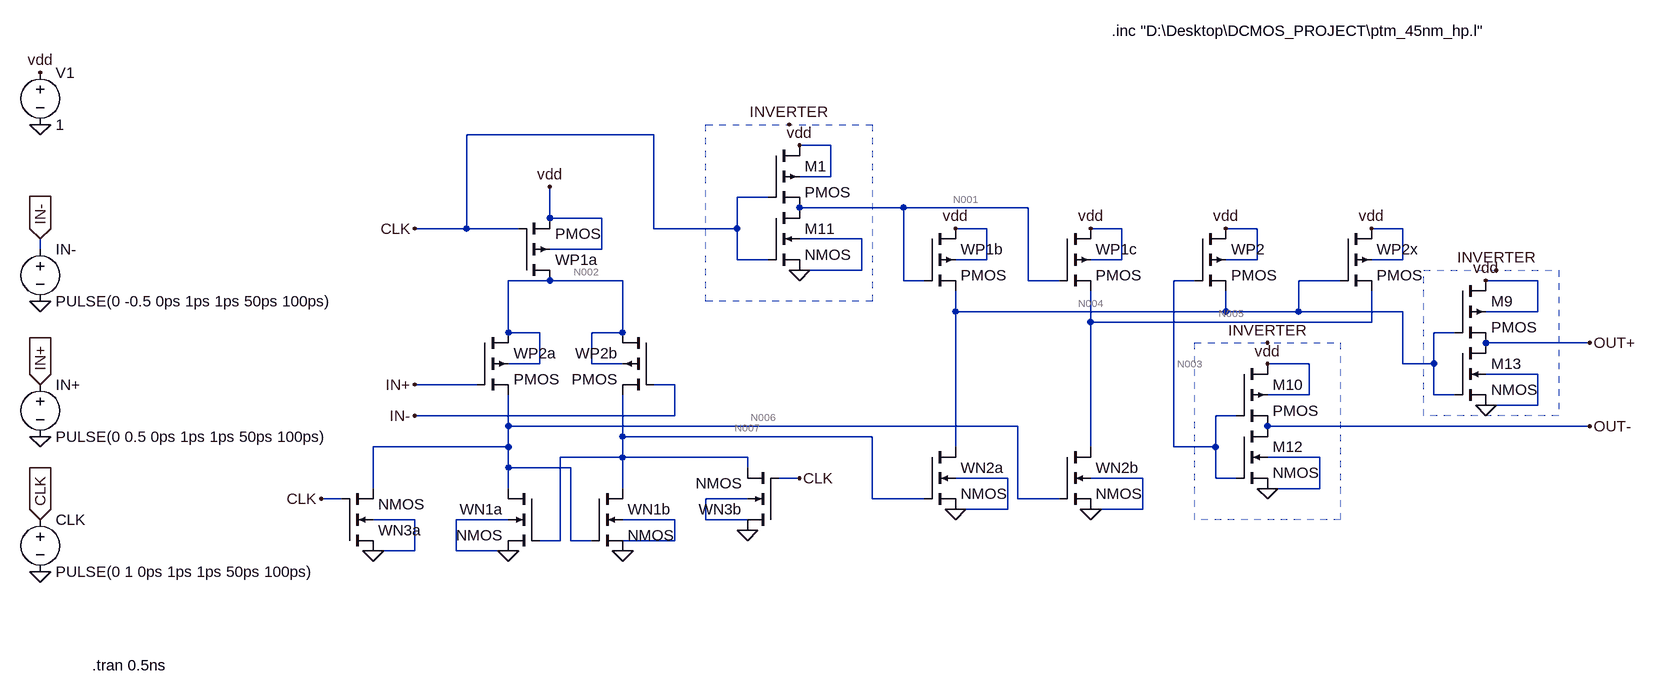
[diagram p0: schematic LSA.asc]
LSA.asc, the LTspice schematic file:
Version 4
SHEET 1 1348 720
WIRE -176 -112 -464 -112
WIRE 96 -96 48 -96
WIRE 96 -48 96 -96
WIRE 96 -48 48 -48
WIRE 0 -16 -48 -16
WIRE 208 0 48 0
WIRE 400 0 208 0
WIRE -336 16 -336 -32
WIRE -256 16 -336 16
WIRE -464 32 -464 -112
WIRE -464 32 -544 32
WIRE -384 32 -464 32
WIRE -176 32 -176 -112
WIRE -48 32 -48 -16
WIRE -48 32 -176 32
WIRE 336 32 288 32
WIRE 544 32 496 32
WIRE 752 32 704 32
WIRE 976 32 928 32
WIRE 144 48 48 48
WIRE -1120 64 -1120 48
WIRE -256 64 -256 16
WIRE -256 64 -336 64
WIRE -48 80 -48 32
WIRE 0 80 -48 80
WIRE 336 80 336 32
WIRE 336 80 288 80
WIRE 544 80 544 32
WIRE 544 80 496 80
WIRE 752 80 752 32
WIRE 752 80 704 80
WIRE 976 80 976 32
WIRE 976 80 928 80
WIRE 144 96 144 48
WIRE 144 96 48 96
WIRE -336 112 -400 112
WIRE -224 112 -336 112
WIRE 208 112 208 0
WIRE 240 112 208 112
WIRE 400 112 400 0
WIRE 448 112 400 112
WIRE 656 112 624 112
WIRE 880 112 816 112
WIRE 1184 112 1104 112
WIRE 288 160 288 128
WIRE 704 160 704 128
WIRE 704 160 288 160
WIRE 816 160 816 112
WIRE 816 160 704 160
WIRE 976 160 816 160
WIRE 1184 160 1184 112
WIRE 1184 160 1104 160
WIRE 496 176 496 128
WIRE 928 176 928 128
WIRE 928 176 496 176
WIRE -400 192 -400 112
WIRE -352 192 -400 192
WIRE -224 192 -224 112
WIRE -224 192 -272 192
WIRE 1056 192 1024 192
WIRE 1264 208 1104 208
WIRE -352 240 -352 192
WIRE -352 240 -400 240
WIRE -272 240 -272 192
WIRE -224 240 -272 240
WIRE 832 240 768 240
WIRE 976 240 976 160
WIRE 1024 240 1024 192
WIRE 1024 240 976 240
WIRE 1184 256 1104 256
WIRE -448 272 -544 272
WIRE -144 272 -176 272
WIRE 832 288 832 240
WIRE 832 288 768 288
WIRE 1024 288 1024 240
WIRE 1056 288 1024 288
WIRE 1184 304 1184 256
WIRE 1184 304 1104 304
WIRE -144 320 -144 272
WIRE -144 320 -544 320
WIRE 720 320 688 320
WIRE -400 336 -400 288
WIRE 384 336 -400 336
WIRE 1264 336 768 336
WIRE -224 352 -224 288
WIRE 160 352 -224 352
WIRE -400 368 -400 336
WIRE -400 368 -608 368
WIRE 288 368 288 160
WIRE 496 368 496 176
WIRE 624 368 624 112
WIRE 688 368 688 320
WIRE 688 368 624 368
WIRE -224 384 -224 352
WIRE -224 384 -320 384
WIRE -32 384 -224 384
WIRE 848 384 768 384
WIRE -400 400 -400 368
WIRE -304 400 -400 400
WIRE -32 400 -32 384
WIRE 48 416 16 416
WIRE 368 416 288 416
WIRE 576 416 496 416
WIRE 688 416 688 368
WIRE 720 416 688 416
WIRE -608 432 -608 368
WIRE -400 432 -400 400
WIRE -224 432 -224 384
WIRE 848 432 848 384
WIRE 848 432 768 432
WIRE -656 448 -688 448
WIRE -32 448 -96 448
WIRE 160 448 160 352
WIRE 240 448 160 448
WIRE 384 448 384 336
WIRE 448 448 384 448
WIRE 368 464 368 416
WIRE 368 464 288 464
WIRE 576 464 576 416
WIRE 576 464 496 464
WIRE -544 480 -608 480
WIRE -400 480 -480 480
WIRE -144 480 -224 480
WIRE -96 480 -96 448
WIRE -32 480 -96 480
WIRE -32 496 -32 480
WIRE -320 512 -320 384
WIRE -320 512 -352 512
WIRE -304 512 -304 400
WIRE -272 512 -304 512
WIRE -144 512 -144 480
WIRE -144 512 -224 512
WIRE -544 528 -544 480
WIRE -544 528 -608 528
WIRE -480 528 -480 480
WIRE -400 528 -480 528
WIRE -224 528 -224 512
FLAG -336 -32 vdd
FLAG 48 -96 vdd
FLAG 288 32 vdd
FLAG 496 32 vdd
FLAG 704 32 vdd
FLAG 928 32 vdd
FLAG 1104 112 vdd
FLAG 768 240 vdd
FLAG -608 528 0
FLAG -400 528 0
FLAG -224 528 0
FLAG 288 464 0
FLAG 496 464 0
FLAG 768 432 0
FLAG 1104 304 0
FLAG 48 96 0
FLAG -32 496 0
FLAG 48 416 CLK
FLAG -688 448 CLK
FLAG -544 32 CLK
FLAG -544 272 IN+
FLAG -544 320 IN-
FLAG 1264 208 OUT+
FLAG 1264 336 OUT-
FLAG 768 208 INVERTER
FLAG 1120 96 INVERTER
FLAG 32 -128 INVERTER
FLAG -1120 352 0
FLAG -1120 560 0
FLAG -1120 144 0
FLAG -1120 48 IN-
IOPIN -1120 48 In
FLAG -1120 272 IN+
IOPIN -1120 272 In
FLAG -1120 480 CLK
IOPIN -1120 480 In
FLAG -1120 -128 0
FLAG -1120 -208 vdd
SYMBOL pmos4 0 -96 R0
SYMATTR InstName M1
SYMATTR Value2 l=45nm w=180nm
SYMBOL pmos4 240 32 R0
SYMATTR InstName WP1b
SYMATTR Value2 l=45nm w=1350nm
SYMBOL pmos4 448 32 R0
SYMATTR InstName WP1c
SYMATTR Value2 l=45nm w=1350nm
SYMBOL pmos4 656 32 R0
SYMATTR InstName WP2
SYMATTR Value2 l=45nm w=270nm
SYMBOL pmos4 -384 112 M180
SYMATTR InstName WP1a
SYMATTR Value2 l=45nm w=1350nm
SYMBOL pmos4 -448 192 R0
SYMATTR InstName WP2a
SYMATTR Value2 l=45nm w=270nm
SYMBOL pmos4 -176 192 M0
SYMATTR InstName WP2b
SYMATTR Value2 l=45nm w=270nm
SYMBOL pmos4 880 32 R0
SYMATTR InstName WP2x
SYMATTR Value2 l=45nm w=270nm
SYMBOL pmos4 1056 112 R0
SYMATTR InstName M9
SYMATTR Value2 l=45nm w=180nm
SYMBOL pmos4 720 240 R0
SYMATTR InstName M10
SYMATTR Value2 l=45nm w=180nm
SYMBOL nmos4 0 0 R0
SYMATTR InstName M11
SYMATTR Value2 l=45nm w=90nm
SYMBOL nmos4 720 336 R0
SYMATTR InstName M12
SYMATTR Value2 l=45nm w=90nm
SYMBOL nmos4 1056 208 R0
SYMATTR InstName M13
SYMATTR Value2 l=45nm w=90nm
SYMBOL nmos4 -656 528 M180
SYMATTR InstName WN3a
SYMATTR Value2 l=45nm w=90nm
SYMBOL nmos4 -352 432 M0
SYMATTR InstName WN1a
SYMATTR Value2 l=45nm w=270nm
SYMBOL nmos4 -272 432 R0
SYMATTR InstName WN1b
SYMATTR Value2 l=45nm w=270nm
SYMBOL nmos4 240 368 R0
SYMATTR InstName WN2a
SYMATTR Value2 l=45nm w=270nm
SYMBOL nmos4 448 368 R0
SYMATTR InstName WN2b
SYMATTR Value2 l=45nm w=270nm
SYMBOL nmos4 16 496 R180
SYMATTR InstName WN3b
SYMATTR Value2 l=45nm w=90nm
SYMBOL voltage -1120 48 R0
WINDOW 123 0 0 Left 0
WINDOW 39 0 0 Left 0
SYMATTR InstName IN-
SYMATTR Value PULSE(0 -0.5 0ps 1ps 1ps 50ps 100ps)
SYMBOL voltage -1120 256 R0
WINDOW 123 0 0 Left 0
WINDOW 39 0 0 Left 0
SYMATTR InstName IN+
SYMATTR Value PULSE(0 0.5 0ps 1ps 1ps 50ps 100ps)
SYMBOL voltage -1120 464 R0
SYMATTR InstName CLK
SYMATTR Value PULSE(0 1 0ps 1ps 1ps 50ps 100ps)
SYMBOL voltage -1120 -224 R0
WINDOW 123 0 0 Left 0
WINDOW 39 0 0 Left 0
SYMATTR InstName V1
SYMATTR Value 1
TEXT 528 -272 Left 2 !.inc "D:\\Desktop\\DCMOS_PROJECT\\ptm_45nm_hp.l"
TEXT -1040 704 Left 2 !.tran 0.5ns
RECTANGLE Normal 160 144 -96 -128 2
RECTANGLE Normal 880 480 656 208 2
RECTANGLE Normal 1216 320 1008 96 2

The netlist it stands for:
* LSA.asc
M1 vdd CLK N001 vdd PMOS l=45nm w=180nm
M§WP1b vdd N001 N004 vdd PMOS l=45nm w=1350nm
M§WP1c vdd N001 N005 vdd PMOS l=45nm w=1350nm
M§WP2 vdd N003 N004 vdd PMOS l=45nm w=270nm
M§WP1a N002 CLK vdd vdd PMOS l=45nm w=1350nm
M§WP2a N002 IN+ N006 N002 PMOS l=45nm w=270nm
M§WP2b N002 IN- N007 N002 PMOS l=45nm w=270nm
M§WP2x vdd N004 N005 vdd PMOS l=45nm w=270nm
M9 vdd N004 OUT+ vdd PMOS l=45nm w=180nm
M10 vdd N003 OUT- vdd PMOS l=45nm w=180nm
M11 N001 CLK 0 0 NMOS l=45nm w=90nm
M12 OUT- N003 0 0 NMOS l=45nm w=90nm
M13 OUT+ N004 0 0 NMOS l=45nm w=90nm
M§WN3a 0 CLK N006 0 NMOS l=45nm w=90nm
M§WN1a N006 N007 0 0 NMOS l=45nm w=270nm
M§WN1b N007 N006 0 0 NMOS l=45nm w=270nm
M§WN2a N004 N007 0 0 NMOS l=45nm w=270nm
M§WN2b N005 N006 0 0 NMOS l=45nm w=270nm
M§WN3b 0 CLK N007 0 NMOS l=45nm w=90nm
V§IN- IN- 0 PULSE(0 -0.5 0ps 1ps 1ps 50ps 100ps)
V§IN+ IN+ 0 PULSE(0 0.5 0ps 1ps 1ps 50ps 100ps)
V§CLK CLK 0 PULSE(0 1 0ps 1ps 1ps 50ps 100ps)
V1 vdd 0 1
.model NMOS NMOS
.model PMOS PMOS
.lib standard.mos
.inc "D:\Desktop\DCMOS_PROJECT\ptm_45nm_hp.l"
.tran 0.5ns
.backanno
.end

* Results of the author's LTspice run, read from the files saved beside the schematic
* Operating Point, zero values left out:
*   V(vdd) = 1 V
*   V(n001) = 1 V
*   V(n004) = 61.35 mV
*   V(n005) = 711.7 mV
*   V(n003) = 491.3 mV
*   V(n002) = 921.2 mV
*   V(n006) = 640.1 mV
*   V(n007) = 640.1 mV
*   V(out+) = 1 V
*   V(out-) = 490.5 mV
*   Id(M1) = 2.753 nA
*   Ig(M1) = -256.1 pA
*   Ib(M1) = 5.31 pA
*   Is(M1) = -2.502 nA
*   Id(Wp1b) = 4.43 nA
*   Ig(Wp1b) = 778.1 pA
*   Is(Wp1b) = -5.209 nA
*   Id(Wp1c) = 202.8 pA
*   Ig(Wp1c) = 28.36 pA
*   Is(Wp1c) = -231.4 pA
*   Id(Wp2) = 40.33 µA
*   Ig(Wp2) = 4.948 pA
*   Ib(Wp2) = 1.167 pA
*   Is(Wp2) = -40.33 µA
*   Id(Wp1a) = -244.6 µA
*   Ig(Wp1a) = -1.897 nA
*   Ib(Wp1a) = 49.85 pA
*   Is(Wp1a) = 244.6 µA
*   Id(Wp2a) = 122.3 µA
*   Ig(Wp2a) = -219 pA
*   Ib(Wp2a) = 3.77 pA
*   Is(Wp2a) = -122.3 µA
*   Id(Wp2b) = 122.3 µA
*   Ig(Wp2b) = -219 pA
*   Ib(Wp2b) = 3.77 pA
*   Is(Wp2b) = -122.3 µA
*   Id(Wp2x) = 128.5 µA
*   Ig(Wp2x) = -239.2 pA
*   Ib(Wp2x) = 5.195 pA
*   Is(Wp2x) = -128.5 µA
*   Id(M9) = 8.553 nA
*   Ig(M9) = -189.8 pA
*   Ib(M9) = 1.684 pA
*   Is(M9) = -8.365 nA
*   Id(M10) = 11.72 µA
*   Ig(M10) = -5.858 pA
*   Is(M10) = -11.72 µA
*   Id(M11) = 1.696 nA
*   Ig(M11) = -12.8 pA
*   Ib(M11) = -1.01 pA
*   Is(M11) = -1.682 nA
*   Id(M12) = 11.72 µA
*   Is(M12) = -11.72 µA
*   Id(M13) = 8.414 nA
*   Ig(M13) = -9.874 pA
*   Ib(M13) = -1.011 pA
*   Is(M13) = -8.403 nA
*   Id(Wn3a) = -445.2 pA
*   Ig(Wn3a) = -2.469 pA
*   Is(Wn3a) = 448.3 pA
*   Id(Wn1a) = 122.3 µA
*   Ig(Wn1a) = 7.205 pA
*   Ib(Wn1a) = -1.134 pA
*   Is(Wn1a) = -122.3 µA
*   Id(Wn1b) = 122.3 µA
*   Ig(Wn1b) = 7.205 pA
*   Ib(Wn1b) = -1.134 pA
*   Is(Wn1b) = -122.3 µA
*   Id(Wn2a) = 40.34 µA
*   Ig(Wn2a) = 8.374 pA
*   Is(Wn2a) = -40.34 µA
*   Id(Wn2b) = 128.5 µA
*   Ig(Wn2b) = 7.218 pA
*   Ib(Wn2b) = -1.299 pA
*   Is(Wn2b) = -128.5 µA
*   Id(Wn3b) = -445.2 pA
*   Ig(Wn3b) = -2.469 pA
*   Is(Wn3b) = 448.3 pA
*   I(In-) = 219 pA
*   I(In+) = 219 pA
*   I(Clk) = 2.171 nA
*   I(V1) = -425.1 µA
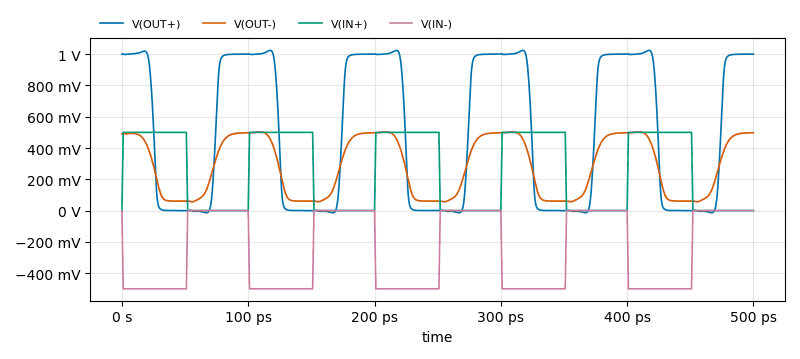
[diagram p1: Transient Analysis of LSA.asc, plotted from the saved traces]
* Transient Analysis, 1 run:
*   V(OUT+): min -13.88 mV, max 1.024 V, average 502.6 mV, rms 693.2 mV, last 999.9 mV
*   V(OUT-): min 56.71 mV, max 502 mV, average 284.7 mV, rms 341.8 mV, last 497.5 mV
*   V(IN+): min 0 V, max 500 mV, average 255 mV, rms 356 mV, last 0 V
*   V(IN-): min -500 mV, max 0 V, average -255 mV, rms 356 mV, last 0 V